# EAGLE design dorthy (EAGLE 9.6.2)
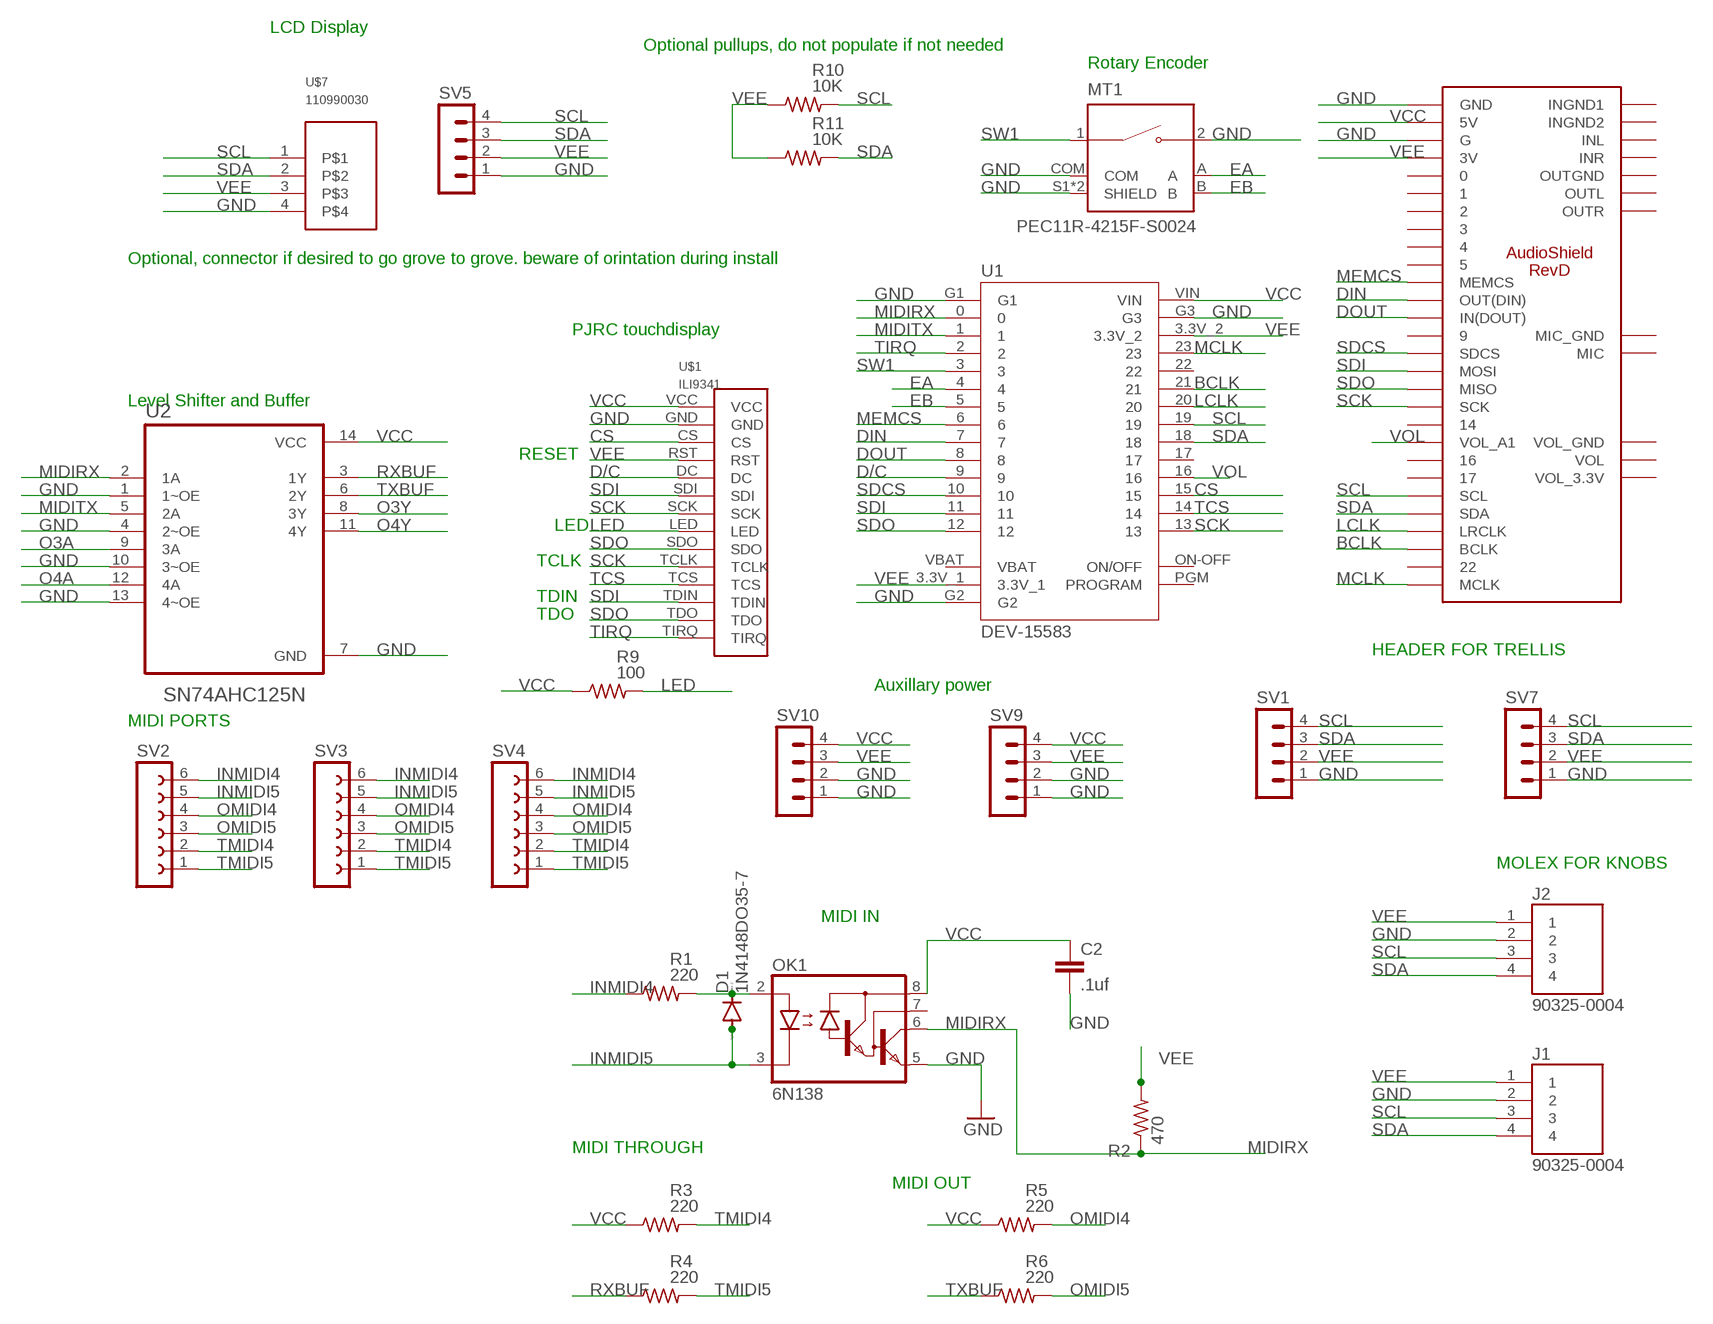
[diagram p0: schematic, sheet 1]

## Parts
C2  .1uf  C5/3.5  [C5B3.5]
D1  1N4148DO35-7  [DO35-7]
J1  90325-0004  [MOLEX_90325-0004]
J2  90325-0004  [MOLEX_90325-0004]
MT1  PEC11R-4215F-S0024  [XDCR_PEC11R-4215F-S0024]
OK1  6N138  [DIL08]
R1  220  R-US_0207/10  [0207/10]
R2  470  R-US_0207/10  [0207/10]
R3  220  R-US_0207/10  [0207/10]
R4  220  R-US_0207/10  [0207/10]
R5  220  R-US_0207/10  [0207/10]
R6  220  R-US_0207/10  [0207/10]
R9  100  R-US_0207/10  [0207/10]
R10  10K  R-US_0207/10  [0207/10]
R11  10K  R-US_0207/10  [0207/10]
SV1  MA04-1  [MA04-1]
SV2  FE06-1  [FE06]
SV3  FE06-1  [FE06]
SV4  FE06-1  [FE06]
SV5  MA04-1  [MA04-1]
SV7  MA04-1  [MA04-1]
SV9  MA04-1  [MA04-1]
SV10  MA04-1  [MA04-1]
U1  DEV-15583  [MODULE_DEV-15583]
U2  SN74AHC125N  [DIP794W45P254L1969H508Q14]
U$1  ILI9341  [ILI9341]
U$2  AUDIOSHIELD-REVD  [AUDIOSHIELD-REVD]
U$7  110990030  [110990030-VERTICAL-GROVE-CONNECTOR]

## Nets
BCLK: U1.21 U$2.21(BCLK)
CS: U1.15 U$1.CS
D/C: U1.9 U$1.DC
DIN: U1.7 U$2.7(OUT(DIN))
DOUT: U1.8 U$2.8(IN(DOUT))
EA: MT1.A U1.4
EB: MT1.B U1.5
GND: C2.2 J1.2 J2.2 MT1.2 MT1.COM MT1.S1(SHIELD) MT1.S2(SHIELD) OK1.5(GND) SV1.1 SV5.1 SV7.1 SV9.1 SV9.2 SV10.1 SV10.2 U1.G1 U1.G2 U1.G3 U2.1(1~OE) U2.4(2~OE) U2.7(GND) U2.10(3~OE) U2.13(4~OE) U$1.GND U$2.G U$2.GND U$7.4
INMIDI4: R1.1 SV2.6 SV3.6 SV4.6
INMIDI5: D1.A OK1.3(C) SV2.5 SV3.5 SV4.5
LCLK: U1.20 U$2.20(LRCLK)
LED: R9.2 U$1.LED
MCLK: U1.23 U$2.23(MCLK)
MEMCS: U1.6 U$2.6(MEMCS)
MIDIRX: OK1.6(VO) R2.1 U1.0 U2.2(1A)
MIDITX: U1.1 U2.5(2A)
N$8: D1.C OK1.2(A) R1.2
O3A: U2.9(3A)
O3Y: U2.8(3Y)
O4A: U2.12(4A)
O4Y: U2.11(4Y)
OMIDI4: R5.2 SV2.4 SV3.4 SV4.4
OMIDI5: R6.2 SV2.3 SV3.3 SV4.3
RXBUF: R4.1 U2.3(1Y)
SCK: U1.13 U$1.SCK U$1.TCLK U$2.13(SCK)
SCL: J1.3 J2.3 R10.2 SV1.4 SV5.4 SV7.4 U1.19 U$2.19(SCL) U$7.1
SDA: J1.4 J2.4 R11.2 SV1.3 SV5.3 SV7.3 U1.18 U$2.18(SDA) U$7.2
SDCS: U1.10 U$2.10(SDCS)
SDI: U1.11 U$1.SDI U$1.TDIN U$2.11(MOSI)
SDO: U1.12 U$1.SDO U$1.TDO U$2.12(MISO)
SW1: MT1.1 U1.3
TCS: U1.14 U$1.TCS
TIRQ: U1.2 U$1.TIRQ
TMIDI4: R3.2 SV2.2 SV3.2 SV4.2
TMIDI5: R4.2 SV2.1 SV3.1 SV4.1
TXBUF: R6.1 U2.6(2Y)
VCC: C2.1 OK1.8(VCC) R3.1 R5.1 R9.1 SV9.4 SV10.4 U1.VIN U2.14(VCC) U$1.VCC U$2.5V
VEE: J1.1 J2.1 R2.2 R10.1 R11.1 SV1.2 SV5.2 SV7.2 SV9.3 SV10.3 U1.3.3V_1 U1.3.3V_2 U$1.RST U$2.3V U$7.3
VOL: U1.16 U$2.15(VOL_A1)
Unconnected: OK1.7(VB) U1.17 U1.22 U1.ON-OFF(ON/OFF) U1.PGM(PROGRAM) U$2.0 U$2.1 U$2.2 U$2.3 U$2.4 U$2.5 U$2.9 U$2.14 U$2.16 U$2.17 U$2.22 U$2.GND_MIC(MIC_GND) U$2.INGND1 U$2.INGND2 U$2.INL U$2.INR U$2.MIC U$2.OUTGND U$2.OUTL U$2.OUTR U$2.VOL U$2.VOL_3.3V U$2.VOL_GND

## Notes on the sheet
- LCD Display
- Optional pullups, do not populate if not needed
- Rotary Encoder
- Optional, connector if desired to go grove to grove. beware of orintation during install
- PJRC touchdisplay
- Level Shifter and Buffer
- RESET
- LED
- TCLK
- TDIN
- TDO
- HEADER FOR TRELLIS
- Auxillary power
- MIDI PORTS
- MOLEX FOR KNOBS
- MIDI IN
- MIDI THROUGH
- MIDI OUT

## Power pins joined to a net without a drawn wire
VBAT: U1.VBAT

## Library data of the parts
C2 = capacitor-wima:C: CAPACITOR naming: grid - package width
D1 = diode:1N4148: DIODE high speed (Philips)
J1 J2 = 90325-0004:90325-0004: Connector Header Through Hole 4 position 0.050" (1.27mm) Check prices <https://pricing.snapeda.com/parts/90325-0004/Molex/view-part?ref=eda>; AVAILABILITY: In Stock; DESCRIPTION: HEADER, PICOFLEX, 4WAY; Connector Type:Wire-to-Board; Gender:Pin; Ways, No. of:4; Lead Spacing:1.27mm; Termination Method:Solder; Contact Material:Brass; Series:PICOFLEX PF50; Contact Plating:Tin; Rows, No. of:1; Colour:Black; Current Rating:1.2A; Flammability Rating:UL94V-0; Material:Polyester; No. of Poles:4; Pitch:1.27mm; Resistance, Contact:10mohm; Temp, Op. Max:105°C; Temp, Op. Min:-25°C; Voltage Rating, AC:250V; Voltage, Withstand:750V; Voltage, Working:250V; Width, External:3.81mm; Wire Size, AWG Max:26AWG; Wire Size, AWG Min:28AWG; Fixing Centres:7.41mm; MF: Molex; MP: 90325-0004; PACKAGE: None; PRICE: None; PURCHASE-URL: https://pricing.snapeda.com/search/part/90325-0004/?ref=eda
MT1 = PEC11R-4215F-S0024:PEC11R-4215F-S0024: Incremental Encoder, 12 Mm, Contact Rating 10 Ma - 5 Vdc Check prices <https://pricing.snapeda.com/parts/PEC11R-4215F-S0024/Bourns/view-part?ref=eda>; AVAILABILITY: In Stock; DESCRIPTION: Rotary Encoder Mechanical 24 Quadrature (Incremental) Vertical; MF: Bourns; MP: PEC11R-4215F-S0024; PACKAGE: None; PRICE: None; PURCHASE-URL: https://pricing.snapeda.com/search/part/PEC11R-4215F-S0024/?ref=eda
OK1 = optocoupler:6N138: MOTOROLA OPTO COUPLER; MF: VISHAY/TELEFUNKEN; MPN: 6N138; OC_FARNELL: 9860150; OC_NEWARK: 35K5294
R1-R6 R9-R11 = rcl:R-US_: RESISTOR, American symbol; SPICEPREFIX: R
SV1 SV5 SV7 SV9 SV10 = con-lstb:MA04-1: PIN HEADER; OC_FARNELL: unknown; OC_NEWARK: unknown
SV2-SV4 = con-lsta:FE06-1: FEMALE HEADER; OC_FARNELL: unknown; OC_NEWARK: unknown
U1 = DEV-15583:DEV-15583: RT1062 Teensy 4.0 i.MX ARM® Cortex®-M7 MPU Embedded Evaluation Board Check prices <https://pricing.snapeda.com/parts/DEV-15583/SparkFun%20Electronics/view-part?ref=eda>; AVAILABILITY: In Stock; DESCRIPTION: RT1062 Teensy 4.0 series ARM® Cortex®-M7 MPU Embedded Evaluation Board; MF: SparkFun Electronics; MP: DEV-15583; PACKAGE: None; PRICE: None; PURCHASE-URL: https://pricing.snapeda.com/search/part/DEV-15583/?ref=eda
U2 = SN74AHC125N:SN74AHC125N: Check prices <https://pricing.snapeda.com/parts/SN74AHC125N/Texas%20Instruments/view-part?ref=eda>; AVAILABILITY: In Stock; DESCRIPTION: Quadruple Bus Buffer Gates With 3-State Outputs 14-PDIP -40 to 125; MF: Texas Instruments; MP: SN74AHC125N; PACKAGE: PDIP-14 Texas Instruments; PRICE: None; PURCHASE-URL: https://pricing.snapeda.com/search/part/SN74AHC125N/?ref=eda
U$1 = ili9341:ILI9341
U$2 = Teensy_Audioshield:AUDIOSHIELD-REVD
U$7 = seeedgrove:110990030

## Board
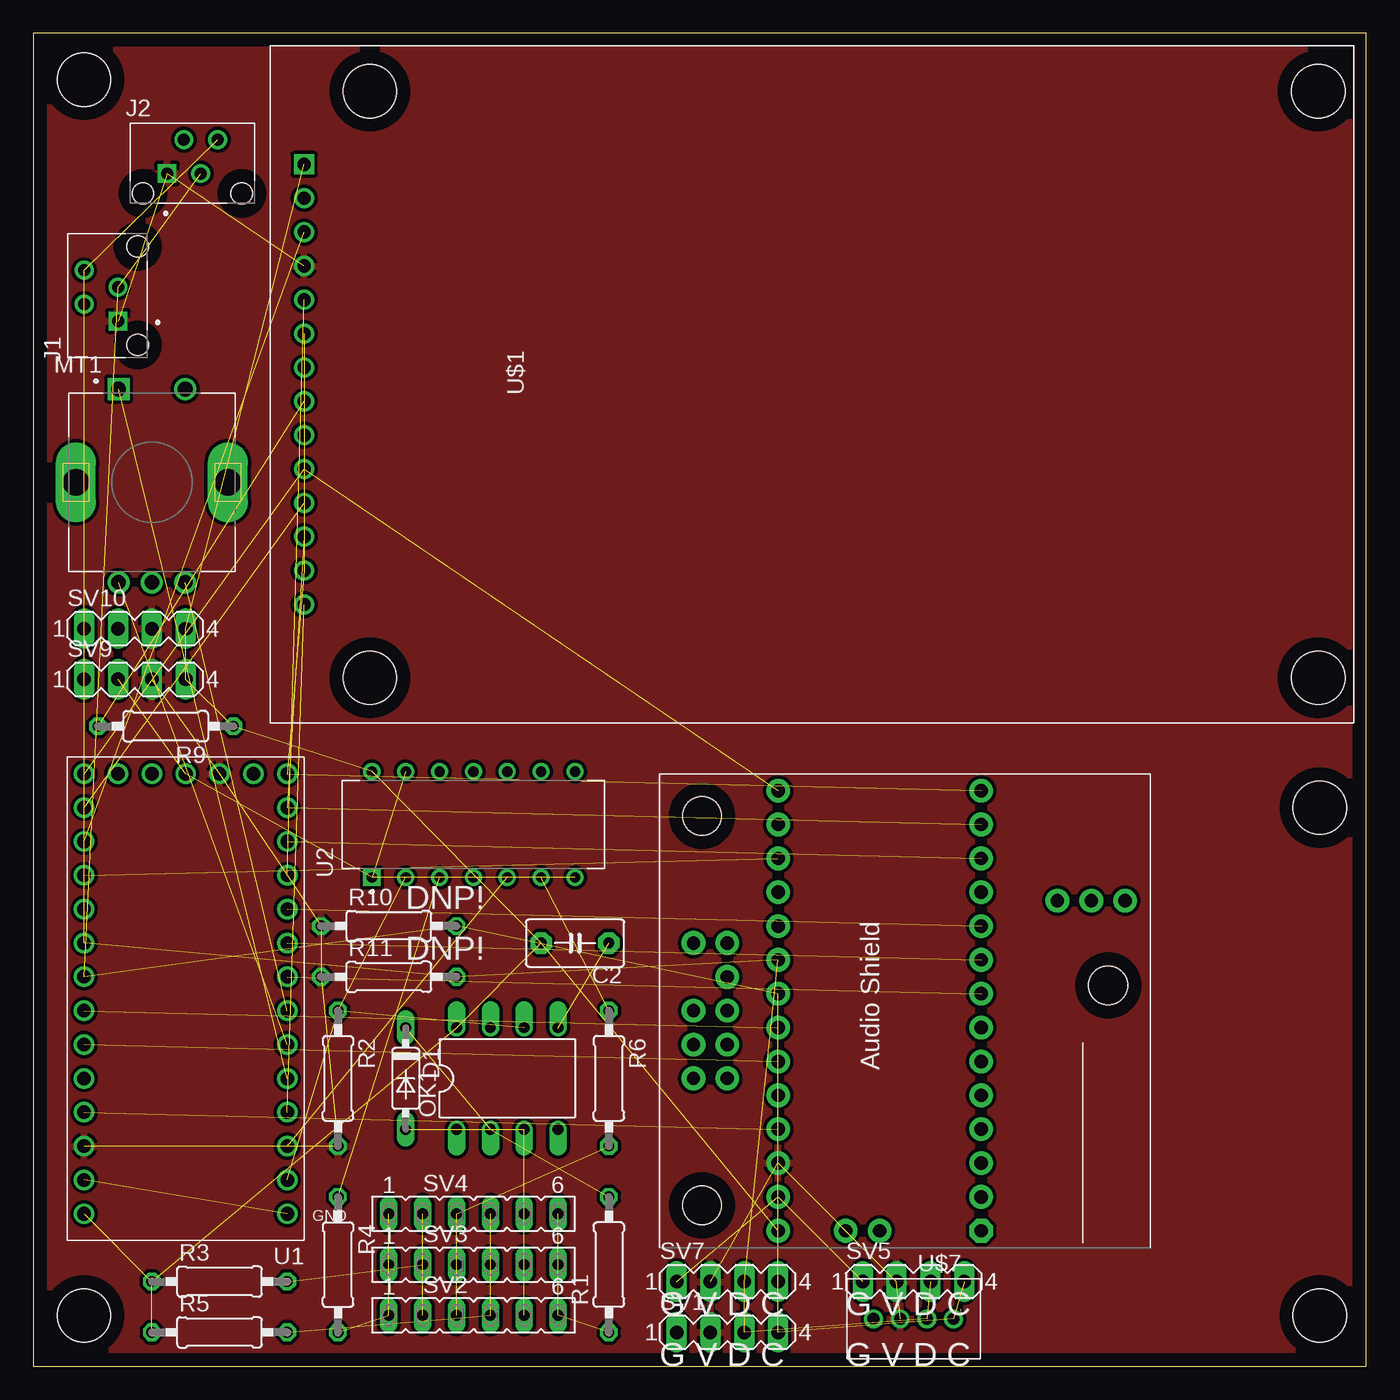
[diagram p1: board, top side]
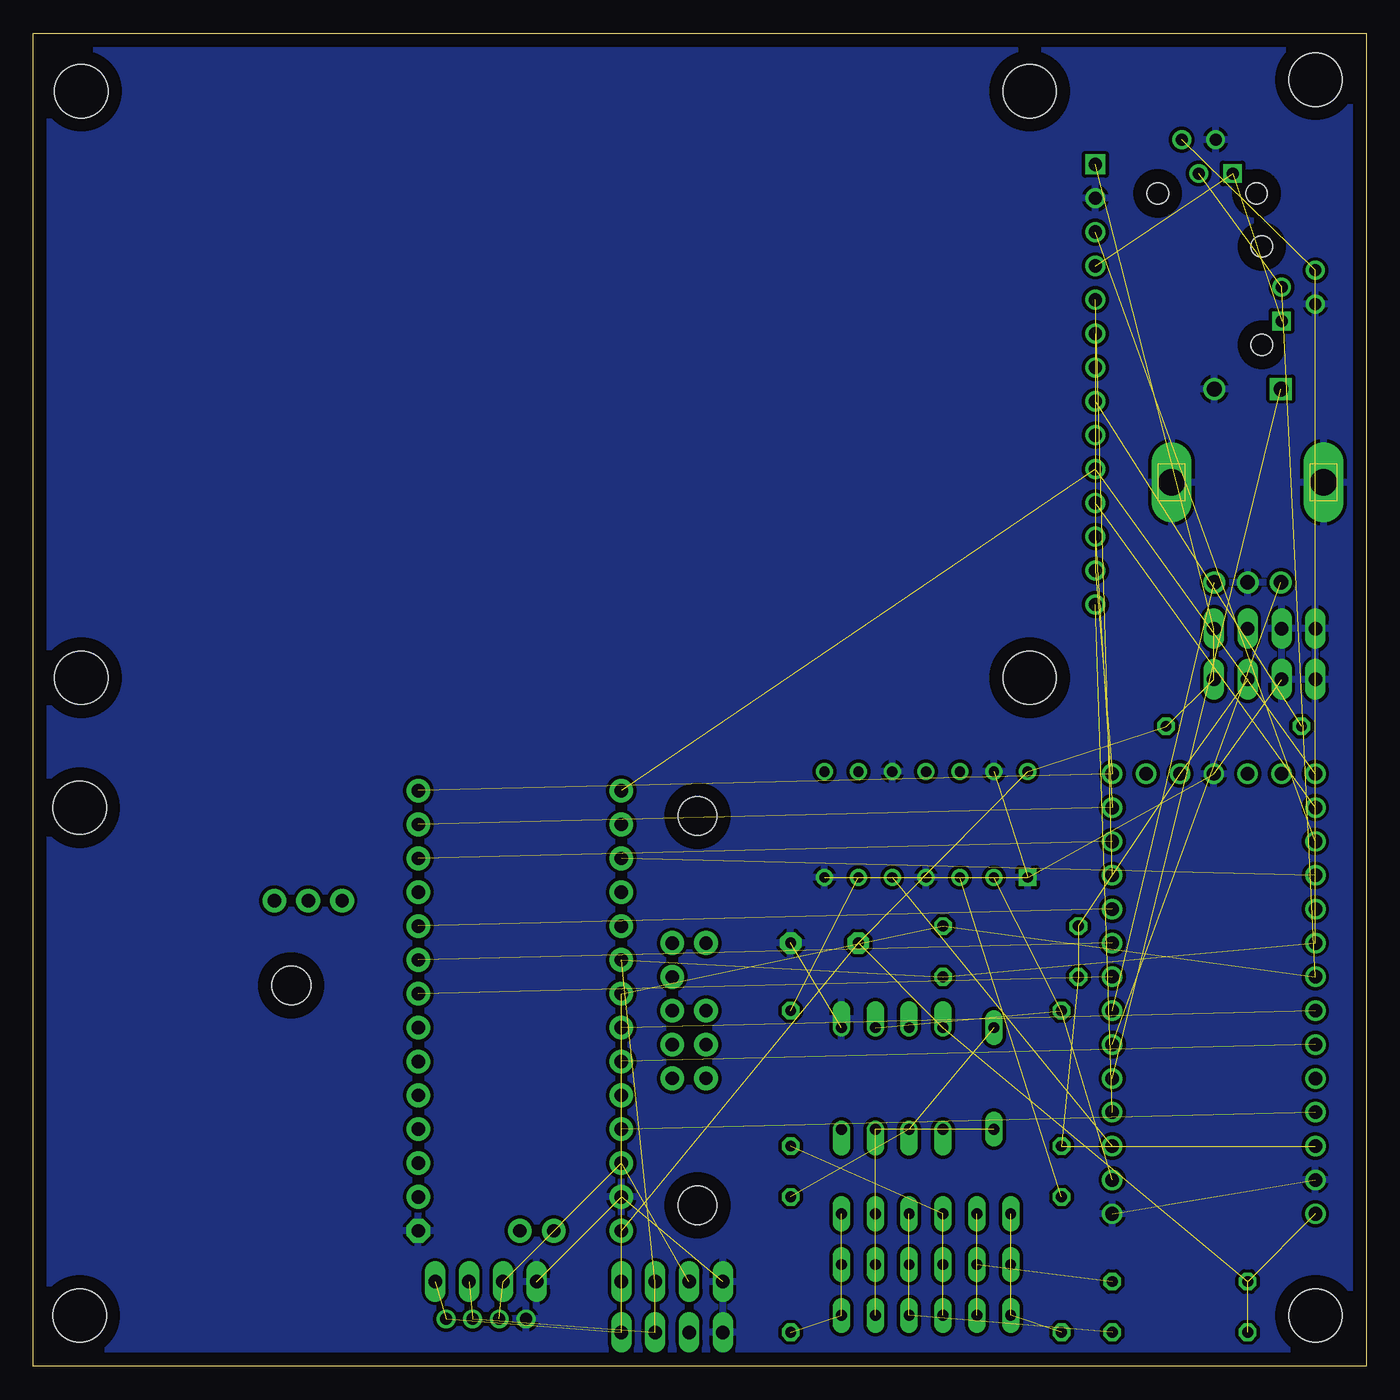
[diagram p2: board, bottom side, seen from below]

Size 100 x 100 mm. Coordinates in mm from the lower left corner, seen from the top.
Outline: 0,0 100,0 100,100 0,100 0,0
Copper layers (1*16): Top 0.035mm / dielectric 1.5mm / Bottom 0.035mm
Design rules "default *": minimum track width 10mil, minimum drill 0.35mm, track to track 10mil, track to pad 10mil, pad to pad 10mil, via to via 10mil, smd to smd 6mil, copper to edge 40mil, drill to drill 6mil, minimum pad ring 10mil, minimum via ring 8mil, stop-mask expansion 4mil, vias tented up to drill 0mil, thermal gap 10mil
Holes 4 mm at 3.81,3.81 96.52,3.81 3.81,96.52 96.52,41.91

### Footprints (pad centres in the part's own frame; a part is rotated, then mirrored left to right if it is on the bottom)
C5B3.5 = drill 0.813 pad 1.6 octagon: 1 -2.54,0; 2 2.54,0
DO35-7 = drill 0.813 long: A 3.81,0; C -3.81,0
MOLEX_90325-0004 = drill 0.9 square: 1 -1.905,-1.27 | drill 0.9: 2 -0.635,1.27; 3 0.635,-1.27; 4 1.905,1.27 | hole 1.6: 3.705,-2.75; -3.705,-2.75
XDCR_PEC11R-4215F-S0024 = drill 1.1 square: 1 -2.5,7 | drill 1.1: 2 2.5,7; A -2.5,-7.5; B 2.5,-7.5; COM 0,-7.5 | drill 2 long: S1 -5.7,0; S2 5.7,0
DIL08 = drill 0.813 offset: 1 -3.81,-3.81; 2 -1.27,-3.81; 3 1.27,-3.81; 4 3.81,-3.81; 5 3.81,3.81; 6 1.27,3.81; 7 -1.27,3.81; 8 -3.81,3.81
0207/10 = drill 0.813 octagon: 1 -5.08,0; 2 5.08,0
MA04-1 = drill 1.016 long: 1 -3.81,0; 2 -1.27,0; 3 1.27,0; 4 3.81,0
FE06 = drill 0.813 long: 1 -6.35,0; 2 -3.81,0; 3 -1.27,0; 4 1.27,0; 5 3.81,0; 6 6.35,0
MODULE_DEV-15583 = drill 1.02: 0 -7.62,13.97; 1 -7.62,11.43; 2 -7.62,8.89; 3 -7.62,6.35; 3.3V_1 -2.54,-16.51; 3.3V_2 7.62,11.43; 4 -7.62,3.81; 5 -7.62,1.27; 6 -7.62,-1.27; 7 -7.62,-3.81; 8 -7.62,-6.35; 9 -7.62,-8.89; 10 -7.62,-11.43; 11 -7.62,-13.97; 12 -7.62,-16.51; 13 7.62,-16.51; 14 7.62,-13.97; 15 7.62,-11.43; 16 7.62,-8.89; 17 7.62,-6.35; 18 7.62,-3.81; 19 7.62,-1.27; 20 7.62,1.27; 21 7.62,3.81; 22 7.62,6.35; 23 7.62,8.89; G1 -7.62,16.51; G2 0,-16.51; G3 7.62,13.97; ON-OFF 5.08,-16.51; PGM 2.54,-16.51; VBAT -5.08,-16.51; VIN 7.62,16.51
DIP794W45P254L1969H508Q14 = drill 0.77 pad 1.17 square: 1 -3.97,7.62 | drill 0.77 pad 1.17: 2 -3.97,5.08; 3 -3.97,2.54; 4 -3.97,0; 5 -3.97,-2.54; 6 -3.97,-5.08; 7 -3.97,-7.62; 8 3.97,-7.62; 9 3.97,-5.08; 10 3.97,-2.54; 11 3.97,0; 12 3.97,2.54; 13 3.97,5.08; 14 3.97,7.62
ILI9341 = drill 1: CS 5.08,0; DC 10.16,0; GND 2.54,0; LED 17.78,0; RST 7.62,0; SCK 15.24,0; SDI 12.7,0; SDO 20.32,0; TCLK 22.86,0; TCS 25.4,0; TDIN 27.94,0; TDO 30.48,0; TIRQ 33.02,0 | drill 1 square: VCC 0,0 | hole 4: -5.49,4.92; 38.51,4.92; -5.49,76.08; 38.51,76.08
AUDIOSHIELD-REVD = drill 1 pad 1.778: 0 -13.97,-5.08; 1 -11.43,-5.08; 2 -8.89,-5.08; 3 -6.35,-5.08; 3V -11.43,10.16; 4 -3.81,-5.08; 5 -1.27,-5.08; 5V -16.51,10.16; 6 1.27,-5.08; 7 3.81,-5.08; 8 6.35,-5.08; 9 8.89,-5.08; 10 11.43,-5.08; 11 13.97,-5.08; 12 16.51,-5.08; 13 16.51,10.16; 14 13.97,10.16; 15 11.43,10.16; 16 8.89,10.16; 17 6.35,10.16; 18 3.81,10.16; 19 1.27,10.16; 20 -1.27,10.16; 21 -3.81,10.16; 22 -6.35,10.16; 23 -8.89,10.16; G -13.97,10.16; GND_MIC -16.51,2.54; INGND1 -5.08,16.51; INGND2 -2.54,16.51; INL -5.08,13.97; INR -2.54,13.97; MIC -16.51,5.08; OUTGND 2.54,13.97; OUTL 5.08,13.97; OUTR 0,13.97; UNUSED1 0,16.51; UNUSED2 5.08,16.51; VOL 8.255,-13.335; VOL_3.3V 8.255,-15.875; VOL_GND 8.255,-10.795 | drill 1 pad 1.778 octagon: GND -16.51,-5.08 | hole 2.921: 1.905,-14.605; -14.605,15.875; 14.605,15.875
110990030-VERTICAL-GROVE-CONNECTOR = drill 0.9 pad 1.27: 1 -3,-1; 2 -1,-1; 3 1,-1; 4 3,-1

### Placement (x,y rotation side)
C2  40.64,31.75 0 top
D1  27.94,21.59 270 top
J1  5.08,80.32 90 top
J2  11.93,90.75 0 top
MT1  8.89,66.31 0 top
OK1  35.56,21.59 0 top
R1  43.18,7.62 90 top
R2  22.86,21.59 270 top
R3  13.97,6.35 0 top
R4  22.86,7.62 270 top
R5  13.97,2.54 0 top
R6  43.18,21.59 270 top
R9  9.93,48.01 180 top
R10  26.67,33.02 0 top
R11  26.67,29.21 0 top
SV1  52.07,2.54 0 top
SV2  33.02,3.81 0 top
SV3  33.02,7.62 0 top
SV4  33.02,11.43 0 top
SV5  66.04,6.35 0 top
SV7  52.07,6.35 0 top
SV9  7.62,51.53 0 top
SV10  7.62,55.34 0 top
U1  11.43,27.94 180 top
U2  33.02,40.64 90 top
U$1  20.32,90.17 270 top
U$2  66.04,26.67 90 top
U$7  66.04,2.54 180 top

### Tracks (layer width: path | path; a pad name or v marks a point on that pad's centre or on a via)
BCLK  (1 unrouted)
CS  (1 unrouted)
D/C  (1 unrouted)
DIN  (1 unrouted)
DOUT  (1 unrouted)
EA  (1 unrouted)
EB  (1 unrouted)
GND  (9 unrouted)
  pour Bottom: 0,0 0,102.87 100.33,102.87 100.33,0
INMIDI4  (3 unrouted)
INMIDI5  (4 unrouted)
LCLK  (1 unrouted)
LED  (1 unrouted)
MCLK  (1 unrouted)
MEMCS  (1 unrouted)
MIDIRX  (3 unrouted)
MIDITX  (1 unrouted)
N$8  (2 unrouted)
OMIDI4  (3 unrouted)
OMIDI5  (3 unrouted)
RXBUF  (1 unrouted)
SCK  (3 unrouted)
SCL  (8 unrouted)
SDA  (8 unrouted)
SDCS  (1 unrouted)
SDI  (3 unrouted)
SDO  (3 unrouted)
SW1  (1 unrouted)
TCS  (1 unrouted)
TIRQ  (1 unrouted)
TMIDI4  (3 unrouted)
TMIDI5  (3 unrouted)
TXBUF  (1 unrouted)
VCC  (10 unrouted)
VEE  (10 unrouted)
  pour Top: 0,0 0,101.6 100.33,101.6 100.33,0
VOL  (1 unrouted)

### Text on the board
tPlace: DNP! | DNP! | G V D C | G V D C | G V D C | G V D C